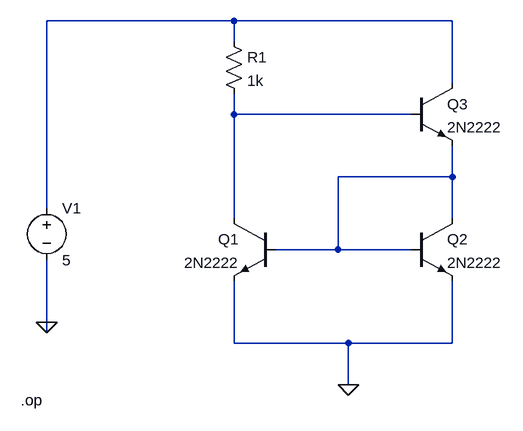
[diagram p0: schematic wilson_bjt_Devresi.asc]
wilson_bjt_Devresi.asc, the LTspice schematic file:
Version 4
SHEET 1 880 680
WIRE 336 -176 48 -176
WIRE 672 -176 336 -176
WIRE 336 -144 336 -176
WIRE 672 -80 672 -176
WIRE 336 -32 336 -64
WIRE 608 -32 336 -32
WIRE 672 64 672 16
WIRE 672 64 496 64
WIRE 48 112 48 -176
WIRE 336 128 336 -32
WIRE 672 128 672 64
WIRE 496 176 496 64
WIRE 496 176 400 176
WIRE 608 176 496 176
WIRE 48 288 48 192
WIRE 48 304 48 288
WIRE 336 320 336 224
WIRE 512 320 336 320
WIRE 672 320 672 224
WIRE 672 320 512 320
WIRE 512 384 512 320
FLAG 512 384 0
FLAG 48 288 0
SYMBOL voltage 48 96 R0
WINDOW 123 0 0 Left 0
WINDOW 39 0 0 Left 0
SYMATTR InstName V1
SYMATTR Value 5
SYMBOL res 320 -160 R0
SYMATTR InstName R1
SYMATTR Value 1k
SYMBOL npn 608 128 R0
SYMATTR InstName Q2
SYMATTR Value 2N2222
SYMBOL npn 400 128 M0
SYMATTR InstName Q1
SYMATTR Value 2N2222
SYMBOL npn 608 -80 R0
SYMATTR InstName Q3
SYMATTR Value 2N2222
TEXT 8 408 Left 2 !.op

The netlist it stands for:
* wilson_bjt_Devresi.asc
V1 N001 0 5
R1 N001 N002 1k
Q2 N003 N003 0 0 2N2222
Q1 N002 N003 0 0 2N2222
Q3 N001 N002 N003 0 2N2222
.model NPN NPN
.model PNP PNP
.lib standard.bjt
.op
.backanno
.end